# Altium schematic sheet 1_Overview.SchDoc: Overview
size A4; DrawnBy: Denis Cooper; Organization: felinefeast.org; Revision: 1.0; SheetNumber: 1; SheetTotal: 5
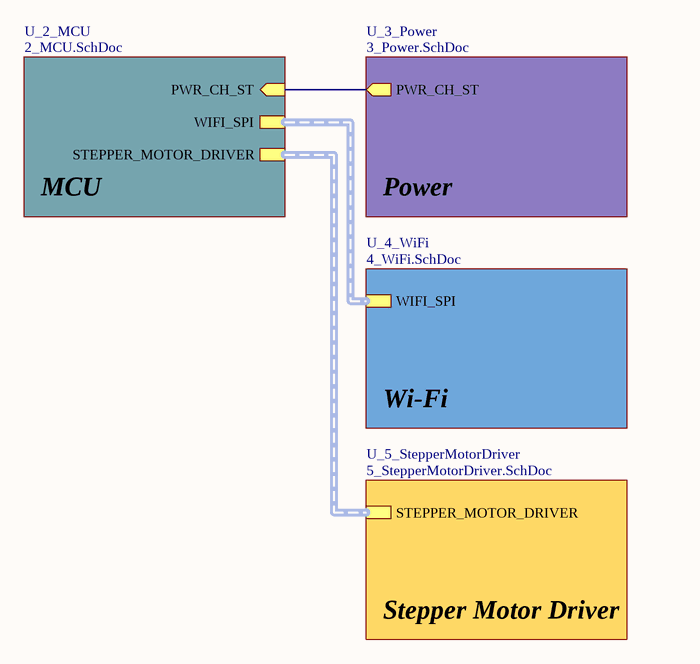
[diagram p0: 1_Overview.SchDoc]

## Sub-sheets
U_2_MCU = 2_MCU.SchDoc: WIFI_SPI (harness WIFI_SPI), PWR_CH_ST (in), STEPPER_MOTOR_DRIVER (harness STEPPER_MOTOR_DRIVER)
U_3_Power = 3_Power.SchDoc: PWR_CH_ST (out)
U_4_WiFi = 4_WiFi.SchDoc: WIFI_SPI (harness WIFI_SPI)
U_5_StepperMotorDriver = 5_StepperMotorDriver.SchDoc: STEPPER_MOTOR_DRIVER (harness STEPPER_MOTOR_DRIVER)

## Nets
(unnamed): sheet U_3_Power/PWR_CH_ST, sheet U_2_MCU/PWR_CH_ST

## Buses and harness runs
harness sheet U_2_MCU/STEPPER_MOTOR_DRIVER = sheet U_5_StepperMotorDriver/STEPPER_MOTOR_DRIVER
harness sheet U_2_MCU/WIFI_SPI = sheet U_4_WiFi/WIFI_SPI

## Notes on the sheet
- MCU
- Power
- Wi-Fi
- Stepper Motor Driver